# Altium schematic sheet serverboard.SchDoc
size A4
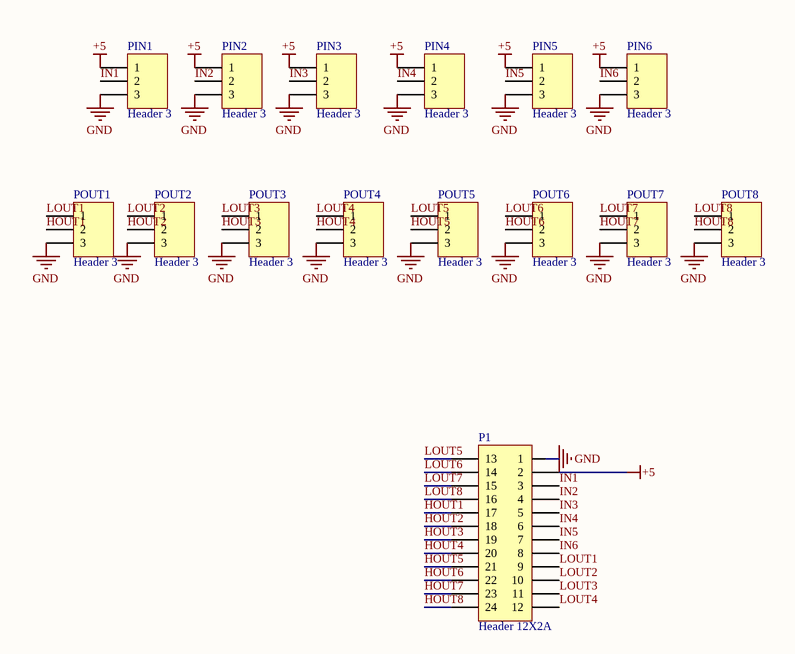
[diagram p0: serverboard.SchDoc]

## Parts
P1  Header 12X2A  [HDR2X12_CEN]
PIN1  Header 3  [HDR1X3]
PIN2  Header 3  [HDR1X3]
PIN3  Header 3  [HDR1X3]
PIN4  Header 3  [HDR1X3]
PIN5  Header 3  [HDR1X3]
PIN6  Header 3  [HDR1X3]
POUT1  Header 3  [HDR1X3]
POUT2  Header 3  [HDR1X3]
POUT3  Header 3  [HDR1X3]
POUT4  Header 3  [HDR1X3]
POUT5  Header 3  [HDR1X3]
POUT6  Header 3  [HDR1X3]
POUT7  Header 3  [HDR1X3]
POUT8  Header 3  [HDR1X3]

## Nets
+5: P1.2 PIN1.1 PIN2.1 PIN3.1 PIN4.1 PIN5.1 PIN6.1
GND: P1.1 PIN1.3 PIN2.3 PIN3.3 PIN4.3 PIN5.3 PIN6.3 POUT1.3 POUT2.3 POUT3.3 POUT4.3 POUT5.3 POUT6.3 POUT7.3 POUT8.3
HOUT1: P1.17 POUT1.2
HOUT2: P1.18 POUT2.2
HOUT3: P1.19 POUT3.2
HOUT4: P1.20 POUT4.2
HOUT5: P1.21 POUT5.2
HOUT6: P1.22 POUT6.2
HOUT7: P1.23 POUT7.2
HOUT8: P1.24 POUT8.2
IN1: P1.3 PIN1.2
IN2: P1.4 PIN2.2
IN3: P1.5 PIN3.2
IN4: P1.6 PIN4.2
IN5: P1.7 PIN5.2
IN6: P1.8 PIN6.2
LOUT1: P1.9 POUT1.1
LOUT2: P1.10 POUT2.1
LOUT3: P1.11 POUT3.1
LOUT4: P1.12 POUT4.1
LOUT5: P1.13 POUT5.1
LOUT6: P1.14 POUT6.1
LOUT7: P1.15 POUT7.1
LOUT8: P1.16 POUT8.1

## Library data of the parts
P1 = Header 12X2A: Header, 12-Pin, Dual row; LatestRevisionDate: 17-Jul-2002; LatestRevisionNote: Re-released for DXP Platform.; Publisher: Altium Limited
PIN1-PIN6 POUT1-POUT8 = Header 3: Header, 3-Pin; LatestRevisionDate: 17-Jul-2002; LatestRevisionNote: Re-released for DXP Platform.; Publisher: Altium Limited